# EAGLE design 24dip-8k (EAGLE 6.6.0)
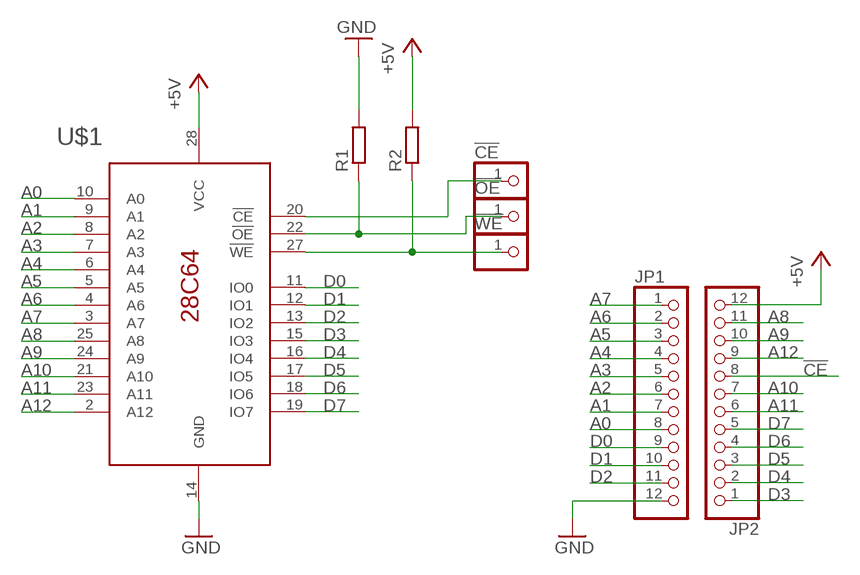
[diagram p0: schematic, sheet 1]

## Parts
!CE  PINHD-1X1  [1X01]
!OE  PINHD-1X1  [1X01]
!WE  PINHD-1X1  [1X01]
JP1  PINHD-1X12  [1X12]
JP2  PINHD-1X12  [1X12]
R1  R-EU_R1206  [R1206]
R2  R-EU_R1206  [R1206]
U$1  AT28C64B28S  [SO28W]

## Nets
!CE: !CE.1 JP2.8 U$1.20(!CE)
+5V: JP2.12 R2.2 U$1.28(VCC)
A0: JP1.8 U$1.10(A0)
A1: JP1.7 U$1.9(A1)
A2: JP1.6 U$1.8(A2)
A3: JP1.5 U$1.7(A3)
A4: JP1.4 U$1.6(A4)
A5: JP1.3 U$1.5(A5)
A6: JP1.2 U$1.4(A6)
A7: JP1.1 U$1.3(A7)
A8: JP2.11 U$1.25(A8)
A9: JP2.10 U$1.24(A9)
A10: JP2.7 U$1.21(A10)
A11: JP2.6 U$1.23(A11)
A12: JP2.9 U$1.2(A12)
D0: JP1.9 U$1.11(IO0)
D1: JP1.10 U$1.12(IO1)
D2: JP1.11 U$1.13(IO2)
D3: JP2.1 U$1.15(IO3)
D4: JP2.2 U$1.16(IO4)
D5: JP2.3 U$1.17(IO5)
D6: JP2.4 U$1.18(IO6)
D7: JP2.5 U$1.19(IO7)
GND: JP1.12 R1.2 U$1.14(GND)
N$1: !WE.1 R2.1 U$1.27(!WE)
N$2: !OE.1 R1.1 U$1.22(!OE)

## Library data of the parts
!CE !OE !WE = pinhead:PINHD-1X1: PIN HEADER
JP1 JP2 = pinhead:PINHD-1X12: PIN HEADER
R1 R2 = rcl:R-EU_: RESISTOR, European symbol
U$1 = eeprom:AT28C64B

## Board
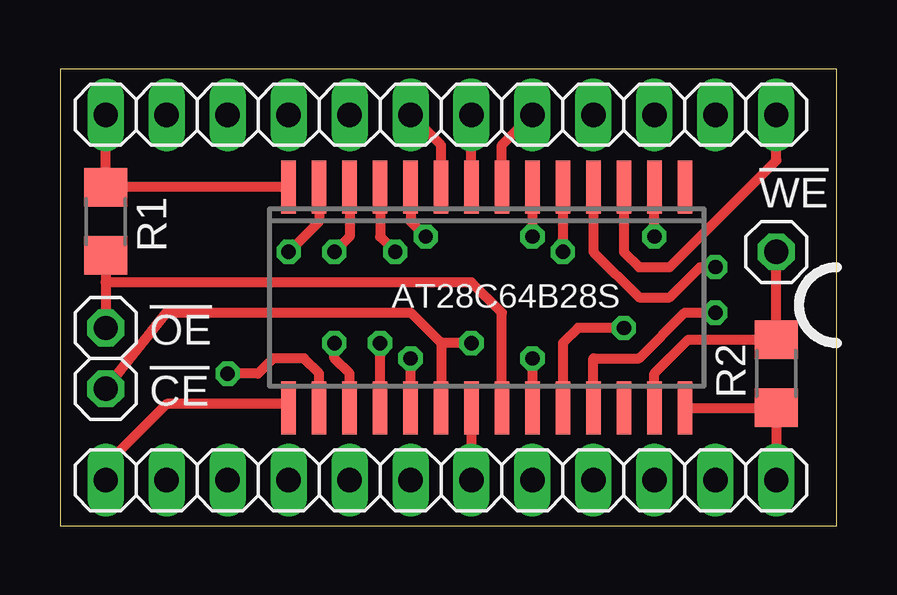
[diagram p1: board, top side]
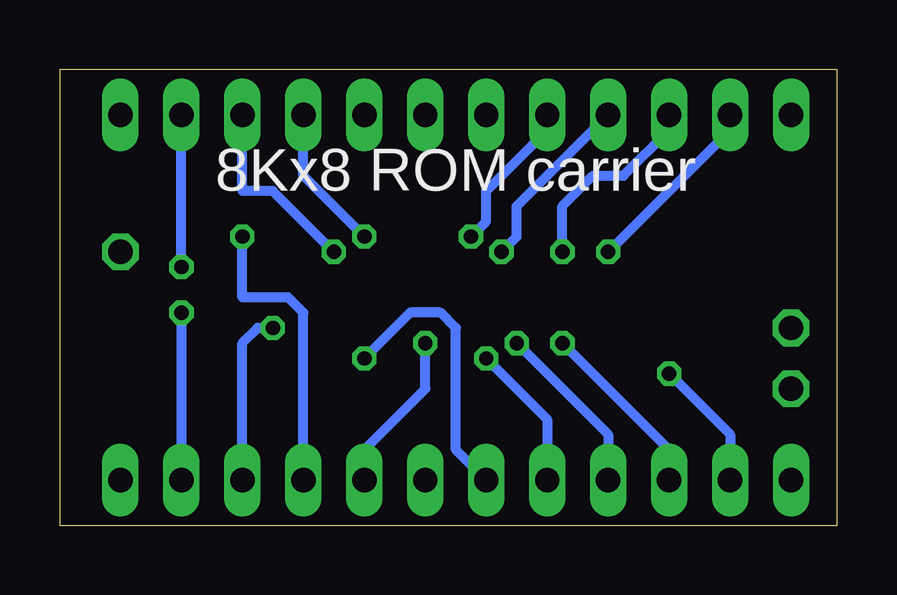
[diagram p2: board, bottom side, seen from below]

Size 32.37 x 19.04 mm. Coordinates in mm from the lower left corner, seen from the top.
Outline: 0,0 32.37,0 32.37,19.04 0,19.04 0,0
Copper layers (1*16): Top 0.035mm / dielectric 1.5mm / Bottom 0.035mm
Design rules "default *": minimum track width 6mil, minimum drill 13mil, track to track 6mil, track to pad 6mil, pad to pad 6mil, via to via 6mil, smd to smd 6mil, copper to edge 18mil, drill to drill 8mil, minimum pad ring 10mil, minimum via ring 8mil, stop-mask expansion 4mil, vias tented up to drill 0mil, thermal gap 10mil

### Footprints (pad centres in the part's own frame; a part is rotated, then mirrored left to right if it is on the bottom)
1X01 = drill 1.016 octagon: 1 0,0
1X12 = drill 1.016 long: 1 -13.97,0; 2 -11.43,0; 3 -8.89,0; 4 -6.35,0; 5 -3.81,0; 6 -1.27,0; 7 1.27,0; 8 3.81,0; 9 6.35,0; 10 8.89,0; 11 11.43,0; 12 13.97,0
R1206 = smd 1.6 x 1.803: 1 -1.422,0; 2 1.422,0
SO28W = smd 0.6 x 2.2: 1 -8.255,-4.6; 2 -6.985,-4.6; 3 -5.715,-4.6; 4 -4.445,-4.6; 5 -3.175,-4.6; 6 -1.905,-4.6; 7 -0.635,-4.6; 8 0.635,-4.6; 9 1.905,-4.6; 10 3.175,-4.6; 11 4.445,-4.6; 12 5.715,-4.6; 13 6.985,-4.6; 14 8.255,-4.6; 15 8.255,4.6; 16 6.985,4.6; 17 5.715,4.6; 18 4.445,4.6; 19 3.175,4.6; 20 1.905,4.6; 21 0.635,4.6; 22 -0.635,4.6; 23 -1.905,4.6; 24 -3.175,4.6; 25 -4.445,4.6; 26 -5.715,4.6; 27 -6.985,4.6; 28 -8.255,4.6

### Placement (x,y rotation side)
!CE  1.91,5.71 0 top
!OE  1.91,8.26 0 top
!WE  29.84,11.43 0 top
JP1  15.88,17.14 180 top
JP2  15.88,1.91 0 top
R1  1.91,12.7 90 top
R2  29.84,6.35 270 top
U$1  17.78,9.53 180 top

### Tracks (layer width: path | path; a pad name or v marks a point on that pad's centre or on a via)
!CE  (via drill 0.6)
  Top 0.406: !CE.1 4.45,8.89 14.61,8.89 15.88,7.62 | 15.88,7.62 U$1.20 | v17.14,7.62 15.88,7.62
  Bottom 0.406: JP2.8 19.68,3.17 17.14,5.71 v17.14,7.62
+5V
  Top 0.406: U$1.28 R2.2 JP2.12
A0  (via drill 0.6)
  Top 0.406: U$1.10 14.61,12.7 v15.24,12.06
  Bottom 0.406: v15.24,12.06 14.61,12.7 14.61,13.97 12.06,16.51 JP1.8
A1
  Top 0.406: U$1.9 15.88,15.88 JP1.7
A2
  Top 0.406: U$1.8 JP1.6
A3
  Top 0.406: U$1.7 18.41,15.88 JP1.5
A4  (via drill 0.6)
  Top 0.406: U$1.6 v19.68,12.06
  Bottom 0.406: v19.68,12.06 22.23,14.61 JP1.4
A5  (via drill 0.6)
  Top 0.406: U$1.5 v20.95,11.43
  Bottom 0.406: v20.95,11.43 23.5,13.97 24.77,13.97 JP1.3
A6  (via drill 0.6)
  Top 0.406: U$1.4 22.23,11.43 24.13,9.53 25.4,9.53 26.67,10.79 v27.3,10.79
  Bottom 0.406: v27.3,10.79 JP1.2
A7
  Top 0.406: U$1.3 23.5,11.43 24.13,10.79 25.4,10.79 29.84,15.24 JP1.1
A8  (via drill 0.6)
  Top 0.406: U$1.25 22.23,6.99 24.13,6.99 26.04,8.89 v27.3,8.89
  Bottom 0.406: v27.3,8.89 JP2.11
A9  (via drill 0.6)
  Top 0.406: v23.5,8.26 21.59,8.26 20.95,7.62 U$1.24
  Bottom 0.406: JP2.10 24.77,7.62 24.13,8.26 v23.5,8.26
A10
  Top 0.406: U$1.21 JP2.7
A11  (via drill 0.6)
  Top 0.406: v19.68,6.99 U$1.23
  Bottom 0.406: JP2.6 15.88,3.17 15.88,8.26 16.51,8.89 17.78,8.89 v19.68,6.99
A12  (via drill 0.6)
  Top 0.406: v24.77,12.06 U$1.2
  Bottom 0.406: JP2.9 22.23,8.89 22.86,9.53 24.77,9.53 v24.77,12.06
D0  (via drill 0.6)
  Top 0.406: U$1.11 13.34,12.06 v13.97,11.43
  Bottom 0.406: v13.97,11.43 13.34,12.06 13.34,13.34 JP1.9
D1  (via drill 0.6)
  Top 0.406: U$1.12 12.06,12.06 v11.43,11.43
  Bottom 0.406: v11.43,11.43 11.43,13.34 10.16,14.61 8.89,14.61 6.99,16.51 JP1.10
D2  (via drill 0.6)
  Top 0.406: U$1.13 10.79,12.7 v9.53,11.43
  Bottom 0.406: v9.53,11.43 4.45,16.51 JP1.11
D3
  Top 0.406: U$1.15 9.37,5.08 4.45,5.08 1.91,2.54 JP2.1
D4  (via drill 0.6)
  Top 0.406: U$1.16 10.79,6.35 10.16,6.99 8.89,6.99 8.26,6.35 v6.99,6.35
  Bottom 0.406: v6.99,6.35 4.45,3.81 JP2.2
D5  (via drill 0.6)
  Top 0.406: U$1.17 12.06,6.35 11.43,6.99 v11.43,7.62
  Bottom 0.406: v11.43,7.62 6.99,3.17 JP2.3
D6  (via drill 0.6)
  Top 0.406: U$1.18 v13.34,7.62
  Bottom 0.406: v13.34,7.62 9.53,3.81 JP2.4
D7  (via drill 0.6)
  Top 0.406: U$1.19 v14.61,6.99
  Bottom 0.406: v14.61,6.99 12.06,4.45 JP2.5
GND
  Top 0.406: U$1.14 R1.2 JP1.12
N$1
  Top 0.406: U$1.27 24.77,6.35 26.19,7.77 R2.1 !WE.1
N$2
  Top 0.406: R1.1 1.91,10.16 | 1.91,10.16 !OE.1 | U$1.22 18.41,8.89 17.14,10.16 1.91,10.16

### Text on the board
bPlace: 8Kx8 ROM carrier